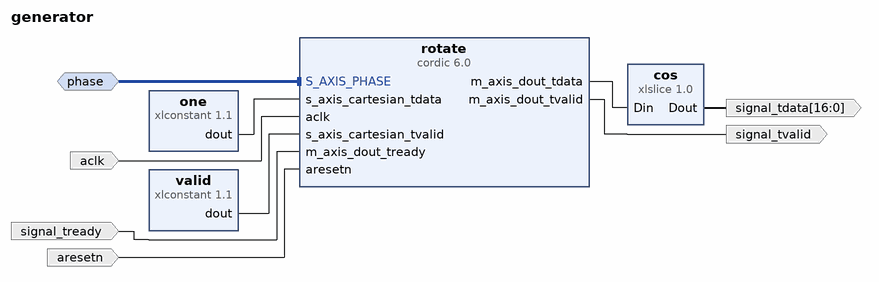
[diagram p0: block diagram of the top level]
# Vivado block design generator, xc7a35ticsg324-1L, Vivado 2019.1
create_bd_design generator

create_bd_intf_port -mode Slave -vlnv xilinx.com:interface:axis_rtl:1.0 phase
set_property -dict [list \
  CONFIG.HAS_TKEEP 0 \
  CONFIG.HAS_TLAST 0 \
  CONFIG.HAS_TREADY 1 \
  CONFIG.HAS_TSTRB 0 \
  CONFIG.LAYERED_METADATA undef \
  CONFIG.TDATA_NUM_BYTES 3 \
  CONFIG.TDEST_WIDTH 0 \
  CONFIG.TID_WIDTH 0 \
  CONFIG.TUSER_WIDTH 0 \
] [get_bd_intf_ports phase]
create_bd_port -dir I -type clk aclk
set_property -dict {CONFIG.FREQ_HZ 100000000} [get_bd_ports aclk]
create_bd_port -dir O signal_tvalid
create_bd_port -dir O -from 16 -to 0 -type data signal_tdata
create_bd_port -dir I signal_tready
create_bd_port -dir I -type rst aresetn

create_bd_cell -type ip -vlnv xilinx.com:ip:xlslice:1.0 cos
set_property -dict {CONFIG.DIN_FROM 16 CONFIG.DIN_TO 0 CONFIG.DIN_WIDTH 48 CONFIG.DOUT_WIDTH 17} [get_bd_cells cos]
create_bd_cell -type ip -vlnv xilinx.com:ip:xlconstant:1.1 one
set_property -dict {CONFIG.CONST_VAL 32768 CONFIG.CONST_WIDTH 48} [get_bd_cells one]
create_bd_cell -type ip -vlnv xilinx.com:ip:xlconstant:1.1 valid
set_property -dict {CONFIG.CONST_VAL 1 CONFIG.CONST_WIDTH 1} [get_bd_cells valid]
create_bd_cell -type ip -vlnv xilinx.com:ip:cordic:6.0 rotate
set_property -dict [list \
  CONFIG.ARESETN true \
  CONFIG.Architectural_Configuration Word_Serial \
  CONFIG.Compensation_Scaling Embedded_Multiplier \
  CONFIG.Input_Width 17 \
  CONFIG.Output_Width 17 \
  CONFIG.Phase_Format Scaled_Radians \
  CONFIG.Pipelining_Mode Maximum \
  CONFIG.Round_Mode Round_Pos_Neg_Inf \
  CONFIG.flow_control Blocking \
  CONFIG.out_tready true \
] [get_bd_cells rotate]

# ---- connections ----

connect_bd_intf_net [get_bd_intf_ports phase] [get_bd_intf_pins rotate/S_AXIS_PHASE]
connect_bd_net [get_bd_ports aclk] [get_bd_pins rotate/aclk]
connect_bd_net [get_bd_pins one/dout] [get_bd_pins rotate/s_axis_cartesian_tdata]
connect_bd_net -net one1_dout [get_bd_pins valid/dout] [get_bd_pins rotate/s_axis_cartesian_tvalid]
connect_bd_net [get_bd_pins rotate/m_axis_dout_tdata] [get_bd_pins cos/Din]
connect_bd_net [get_bd_pins rotate/m_axis_dout_tvalid] [get_bd_ports signal_tvalid]
connect_bd_net [get_bd_pins cos/Dout] [get_bd_ports signal_tdata]
connect_bd_net [get_bd_ports signal_tready] [get_bd_pins rotate/m_axis_dout_tready]
connect_bd_net [get_bd_ports aresetn] [get_bd_pins rotate/aresetn]

validate_bd_design
save_bd_design
